# Altium schematic sheet Sensors.SchDoc
size A4
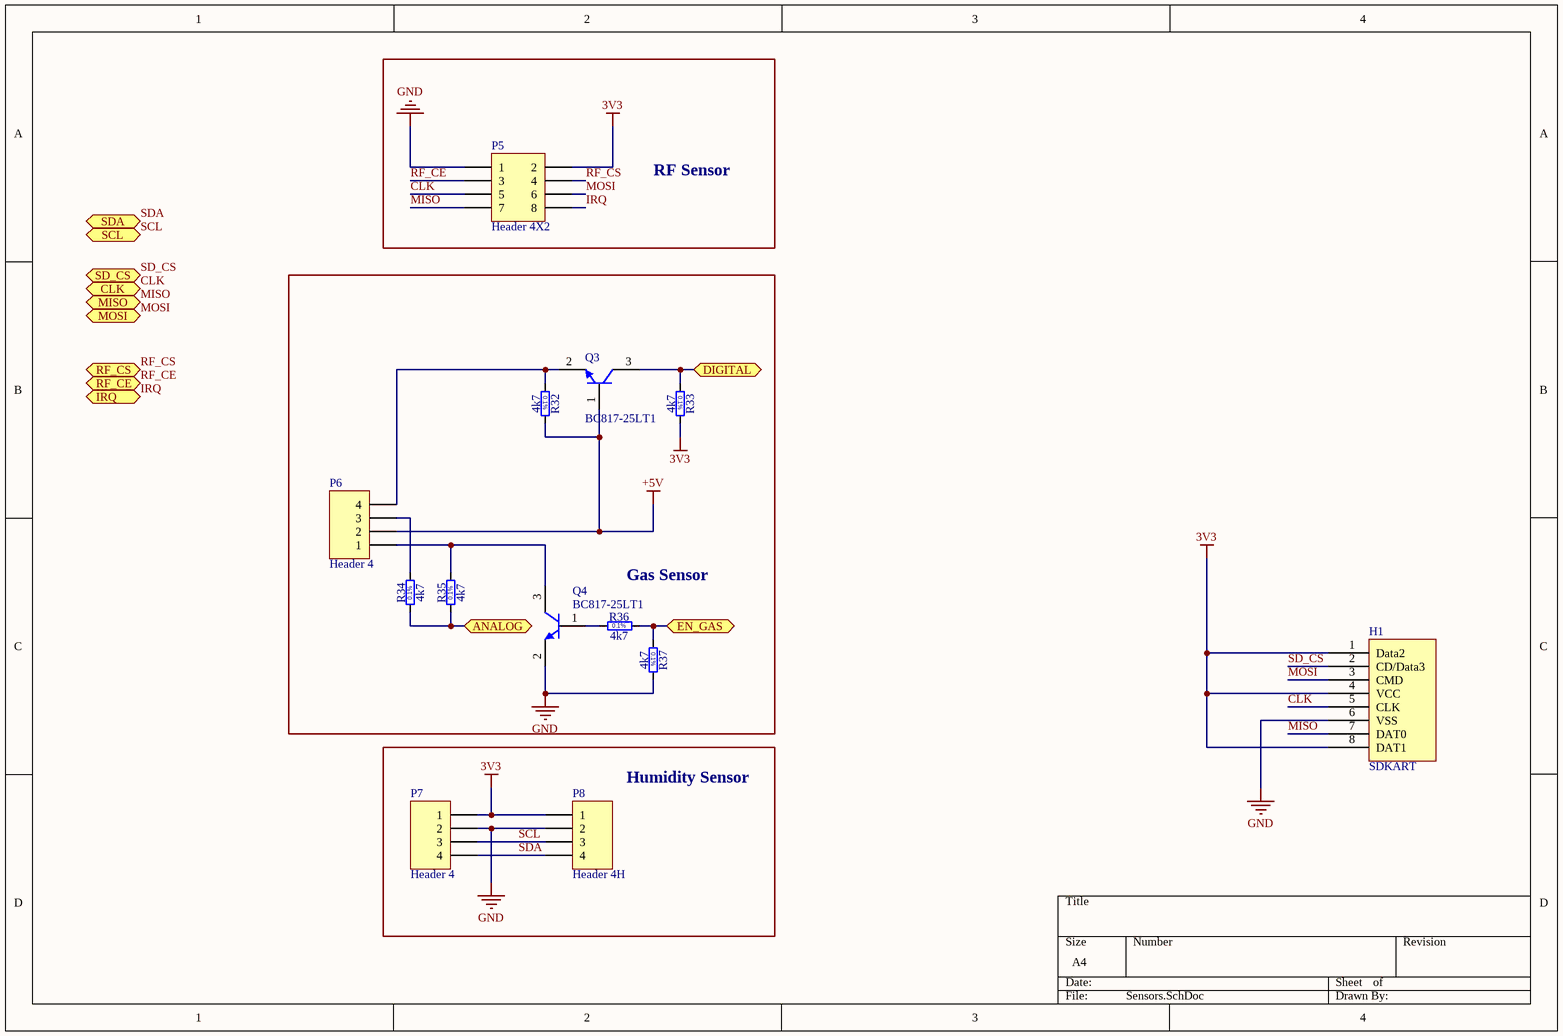
[diagram p0: Sensors.SchDoc]

## Parts
H1  SDKART  [PCBComponent_1]
P5  Header 4X2  [HDR2X4]
P6  Header 4  [HDR1X4]
P7  Header 4  [HDR1X4]
P8  Header 4H  [HDR1X4H]
Q3  BC817-25LT1  [ONSC-SOT-23-3-318-08_V]
Q4  BC817-25LT1  [ONSC-SOT-23-3-318-08_V]
R32  4k7  [RESC2012X60N]
R33  4k7  [RESC2012X60N]
R34  4k7  [RESC2012X60N]
R35  4k7  [RESC2012X60N]
R36  4k7  [RESC2012X60N]
R37  4k7  [RESC2012X60N]

## Blocks framed on the sheet
RF Sensor: P5
Gas Sensor: P6 Q3 Q4 R32-R37
Humidity Sensor: P7 P8

## Ports
ANALOG, CLK, DIGITAL, EN_GAS, IRQ, MISO, MOSI, RF_CE, RF_CS, SCL, SD_CS, SDA

## Nets
3V3: H1.1(Data2) H1.4(VCC) H1.8(DAT1) P5.2 P7.1 P8.1 R33.2
+5V: P6.2 Q3.1(B) R32.2
GND: H1.6(VSS) P5.1 P7.2 P8.2 Q4.2(E) R37.2
ANALOG: R34.1 R35.1 ; port ANALOG
CLK: H1.5(CLK) P5.5 ; port CLK
DIGITAL: Q3.3(C) R33.1 ; port DIGITAL
EN_GAS: R36.2 R37.1 ; port EN_GAS
IRQ: P5.8 ; port IRQ
MISO: H1.7(DAT0) P5.7 ; port MISO
MOSI: H1.3(CMD) P5.6 ; port MOSI
RF_CE: P5.3 ; port RF_CE
RF_CS: P5.4 ; port RF_CS
SCL: P7.3 P8.3 ; port SCL
SD_CS: H1.2(CD/Data3) ; port SD_CS
SDA: P7.4 P8.4 ; port SDA
NetP6_1: P6.1 Q4.3(C) R35.2
NetP6_3: P6.3 R34.2
NetP6_4: P6.4 Q3.2(E) R32.1
NetQ4_1: Q4.1(B) R36.1

## Notes on the sheet
- (in symbol R0805_1K1_0.1%_0.1W_10PPM) 0.1%

## Library data of the parts
P5 = Header 4X2: Header, 4-Pin, Dual row; LatestRevisionDate: 17-Jul-2002; LatestRevisionNote: Re-released for DXP Platform.; Publisher: Altium Limited
P6 P7 = Header 4: Header, 4-Pin; LatestRevisionDate: 17-Jul-2002; LatestRevisionNote: Re-released for DXP Platform.; Publisher: Altium Limited
P8 = Header 4H: Header, 4-Pin, Right Angle; LatestRevisionDate: 17-Jul-2002; LatestRevisionNote: Re-released for DXP Platform.; Publisher: Altium Limited
Q3 Q4 = BC817-25LT1: General Purpose Transistor, NPN Silicon, 3-Pin SOT-23, Tape and Reel; Manufacturer: On Semiconductor; fT Min (MHz): 100; IC Continuous (A): 0.5; DatasheetVersion: Rev. 12; PackageVersion: Rev. AP, 11/2009; PackageReference: SOT-23-3-318-08; PackageDescription: 3-Pin Small Outline Transistor, Body 2.92 x 1.3 mm, Pitch 0.95 mm; Supplier 1: Digi-Key; Supplier Part Number 1: BC817-25LT1OSCT-ND; Packing: Tape and Reel; Polarity: NPN; RoHS: FALSE; Mounting Technology: Surface Mount; PartNumber: BC817-25LT1; ComponentLink1Description: Manufacturer URL; ComponentLink1URL: http://www.onsemi.com/; ComponentLink2Description: Datasheet; ComponentLink2URL: http://www.onsemi.com/pub_link/Collateral/BC817-16LT1-D.PDF; ComponentLink3Description: Package Specification; ComponentLink3URL: http://www.onsemi.cn/pub_link/Collateral/318-08.PDF
R32-R37 = R0805_1K1_0.1%_0.1W_10PPM: Resistor - 0.1%; Part Description: Thin Film Chip Resistor; Manufacturer: GENERIC; Manufacturer1 Part Number: RN73C2A1K1BTG; Power: 0.1W; TC: ±10ppm; Table: Resistors SMD; Part Number: R0805_1K1_0.1%_0.1W_10PPM; Component Kind: Standard; Component Type: Standard; Pin Count: 2; Value: 4k7; Status: Not recommended; Tolerance: ±0.1%; Manufacturer Part Number: R0805_1K1_0.1%_0.1W_10PPM; Case: 0805; Mounted: Yes; Socket: No; SMD: Yes; Manufacturer1 Example: TYCO HOLSWORTHY; Manufacturer1 ComponentHeight: 0.6mm; HelpURL: \\cern.ch\dfs\Applications\Altium\Datasheets\R0805_Tyco_RN73.pdf; Author: CERN DEM JLC; CreateDate: 03.12.2007; LatestRevisionDate: 13.03.2008